# EAGLE design Mjolnir (EAGLE 9.6.2)
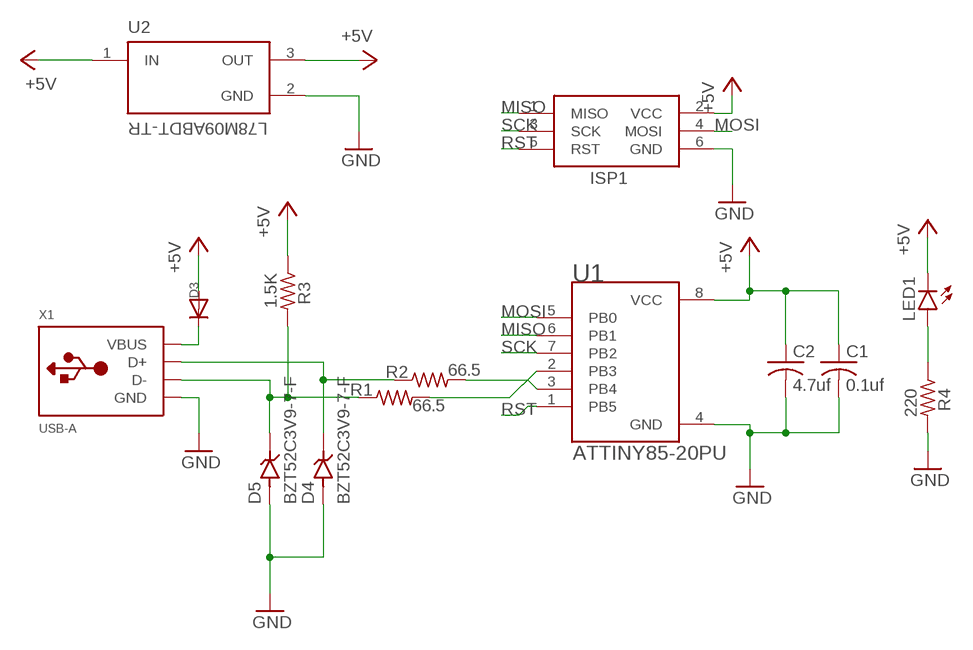
[diagram p0: schematic, sheet 1]

## Parts
C1  0.1uf  C-USC0805  [C0805]
C2  4.7uf  C-USC0805  [C0805]
D3  DIODESOD-123  [SOD-123]
D4  BZT52C3V9-7-F  [SOD3715X145N]
D5  BZT52C3V9-7-F  [SOD3715X145N]
ISP1  AVRISP-6  [AVRISP]
LED1  LEDCHIPLED_0805  [CHIPLED_0805]
R1  66.5  R-US_R0805  [R0805]
R2  66.5  R-US_R0805  [R0805]
R3  1.5K  R-US_R0805  [R0805]
R4  220  R-US_R0805  [R0805]
U1  ATTINY85-20PU  [DIP762W46P254L927H533Q8B]
U2  L78M09ABDT-TR  [VREG_L78M09ABDT-TR]
X1  USB-A  [MOLEX_480371000]

## Nets
+5V: C1.1 C2.1 D3.A ISP1.2(VCC) LED1.C R3.1 U1.8(VCC) U2.1(IN) U2.3(OUT)
GND: C1.2 C2.2 D4.A D5.A ISP1.6(GND) R4.2 U1.4(GND) U2.2(GND) X1.4(GND)
MISO: ISP1.1(MISO) U1.6(PB1)
MOSI: ISP1.4(MOSI) U1.5(PB0)
N$1: LED1.A R4.1
N$2: D3.C X1.1(VBUS)
N$3: D5.C R1.1 R3.2 X1.2(D-)
N$4: R2.2 U1.3(PB4)
N$5: D4.C R2.1 X1.3(D+)
N$6: R1.2 U1.2(PB3)
RST: ISP1.5(RST) U1.1(PB5)
SCK: ISP1.3(SCK) U1.7(PB2)

## Library data of the parts
C1 C2 = adafruit:C-US: CAPACITOR, American symbol
D3 = adafruit:DIODE: Diode SMADIODE - SMA Surface Mount Package 20V 1A Schottky Diode Digikey: 641-1014-6-ND DO-1N4148 - Through Hole Small Current Diode SOD-123 20V 1 A (.5mV Vf) Schottky Diode - Digikey: MBRX120TPMSCT-ND SOD-323 10V 570mA (.38mV Vf, 3ns) Schottky Diode - Digikey: ZLLS410CT-ND SOD-523 30V 30mA Schottky Diode (RB751S-40TE61) - Digikey: RB751S-40TE61CT-ND SOT23-R/W - SOT23 Package (R = Solder Paste/Reflow Ovens, W = Hand-Soldering) BAT54Film 40V 300mA - Digikey: 497-7162-1-ND
D4 D5 = BZT52C3V9-7-F:BZT52C3V9-7-F: Zener Diode 3.9V 500mW ±5% Surface Mount SOD-123 Check prices <https://pricing.snapeda.com/parts/BZT52C3V9-7-F/Diodes%20Inc./view-part?ref=eda>; AVAILABILITY: In Stock; DESCRIPTION: Zener Diode 3.9V 500mW ±5% Surface Mount SOD-123; MF: Diodes Inc.; MP: BZT52C3V9-7-F; PACKAGE: SOD-123 Fairchild Semiconductor; PRICE: None
ISP1 = adafruit:AVRISP: AVR ISP HEADER Standard 6 pin header for AVR programming
LED1 = led:LED: LED OSRAM: - CHIPLED LG R971, LG N971, LY N971, LG Q971, LY Q971, LO R971, LY R971 LH N974, LH R974 LS Q976, LO Q976, LY Q976 LO Q996 - Hyper CHIPLED LW Q18S LB Q993, LB Q99A, LB R99A - SideLED LS A670, LO A670, LY A670, LG A670, LP A670 LB A673, LV A673, LT A673, LW A673 LH A674 LY A675 LS A676, LA A676, LO A676, LY A676, LW A676 LS A679, LY A679, LG A679 - Hyper Micro SIDELED® LS Y876, LA Y876, LO Y876, LY Y876 LT Y87S - SmartLED LW L88C, LW L88S LB L89C, LB L89S, LG L890 LS L89K, LO L89K, LY L89K LS L896, LA L896, LO L896, LY L896 - TOPLED LS T670, LO T670, LY T670, LG T670, LP T670 LSG T670, LSP T670, LSY T670, LOP T670, LYG T670 LG T671, LOG T671, LSG T671 LB T673, LV T673, LT T673, LW T673 LH T674 LS T676, LA T676, LO T676, LY T676, LB T676, LH T676, LSB T676, LW T676 LB T67C, LV T67C, LT T67C, LS T67K, LO T67K, LY T67K, LW E67C LS E67B, LA E67B, LO E67B, LY E67B, LB E67C, LV E67C, LT E67C LW T67C LS T679, LY T679, LG T679 LS T770, LO T770, LY T770, LG T770, LP T770 LB T773, LV T773, LT T773, LW T773 LH T774 LS E675, LA E675, LY E675, LS T675 LS T776, LA T776, LO T776, LY T776, LB T776 LHGB T686 LT T68C, LB T68C - Hyper Mini TOPLED® LB M676 - Mini TOPLED Santana® LG M470 LS M47K, LO M47K, LY M47K Source: http://www.osram.convergy.de LUXEON: - LUMILED® LXK2-PW12-R00, LXK2-PW12-S00, LXK2-PW14-U00, LXK2-PW14-V00 LXK2-PM12-R00, LXK2-PM12-S00, LXK2-PM14-U00 LXK2-PE12-Q00, LXK2-PE12-R00, LXK2-PE12-S00, LXK2-PE14-T00, LXK2-PE14-U00 LXK2-PB12-K00, LXK2-PB12-L00, LXK2-PB12-M00, LXK2-PB14-N00, LXK2-PB14-P00, LXK2-PB14-Q00 LXK2-PR12-L00, LXK2-PR12-M00, LXK2-PR14-Q00, LXK2-PR14-R00 LXK2-PD12-Q00, LXK2-PD12-R00, LXK2-PD12-S00 LXK2-PH12-R00, LXK2-PH12-S00 LXK2-PL12-P00, LXK2-PL12-Q00, LXK2-PL12-R00 Source: www.luxeon.com KINGBRIGHT: KA-3528ASYC Source: www.kingbright.com
R1-R4 = adafruit:R-US_: RESISTOR, American symbol
U1 = ATTINY85-20PU:ATTINY85-20PU: ATtiny Series 20 MHz 8 KB Flash 512 B SRAM 8-Bit Microcontroller - DIP-8 Check prices <https://pricing.snapeda.com/parts/ATTINY85-20PU/Microchip%20Technology/view-part?ref=eda>; AVAILABILITY: In Stock; DESCRIPTION: AVR AVR® ATtiny, Functional Safety (FuSa) Microcontroller IC 8-Bit 20MHz 8KB (4K x 16) FLASH 8-PDIP; MF: Microchip Technology; MP: ATTINY85-20PU; PACKAGE: DIP-8 Atmel; PRICE: None
U2 = L78M09ABDT-TR:L78M09ABDT-TR: Linear Voltage Regulator IC 1 Output 500mA DPAK Check prices <https://pricing.snapeda.com/parts/L78M09ABDT-TR/STMicroelectronics/view-part?ref=eda>; AVAILABILITY: In Stock; DESCRIPTION: Linear Voltage Regulator IC Positive Fixed 1 Output 500mA DPAK; MF: STMicroelectronics; MP: L78M09ABDT-TR; PACKAGE: TO-252 STMicroelectronics; PRICE: None
X1 = adafruit:USB-A: USB type A 'plug' Used for things that can directly connect to a USB port, say USB key

## Board
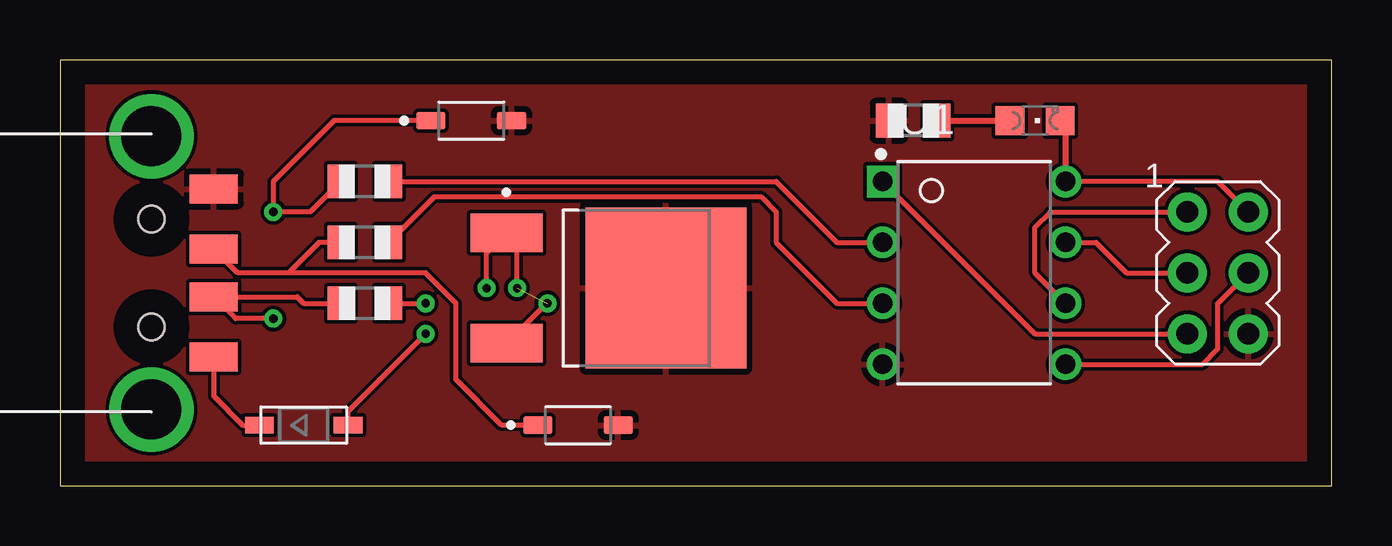
[diagram p1: board, top side]
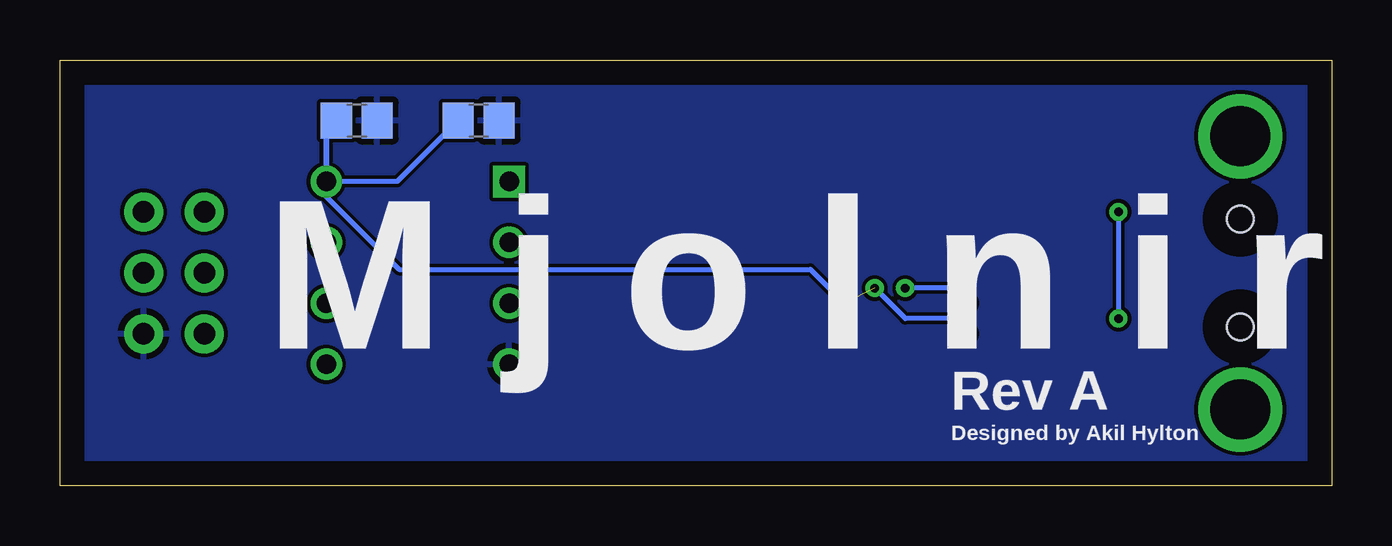
[diagram p2: board, bottom side, seen from below]

Size 53.01 x 17.77 mm. Coordinates in mm from the lower left corner, seen from the top.
Outline: 0,0 53.01,0 53.01,17.77 0,17.77 0,0
Copper layers (1*16): Top 0.035mm / dielectric 1.5mm / Bottom 0.035mm
Design rules "default": minimum track width 6mil, minimum drill 0.35mm, track to track 6mil, track to pad 6mil, pad to pad 6mil, via to via 6mil, smd to smd 6mil, copper to edge 40mil, drill to drill 6mil, minimum pad ring 10mil, minimum via ring 8mil, stop-mask expansion 4mil, vias tented up to drill 0mil, thermal gap 10mil

### Footprints (pad centres in the part's own frame; a part is rotated, then mirrored left to right if it is on the bottom)
C0805 = smd 1.3 x 1.5: 1 -0.85,0; 2 0.85,0
SOD-123 = smd 1.2 x 0.7: A 1.85,0; C -1.85,0
SOD3715X145N = smd 1.21 x 0.73: A 1.68,0; C -1.68,0
AVRISP = drill 0.9 pad 1.626: 1 -1.27,2.54; 2 1.27,2.54; 3 -1.27,0; 4 1.27,0; 5 -1.27,-2.54; 6 1.27,-2.54
CHIPLED_0805 = smd 1.2 x 1.2: A 0,-1.05; C 0,1.05
R0805 = smd 1.1 x 1.4: 1 -1,0; 2 1,0
DIP762W46P254L927H533Q8B = drill 0.813 square: 1 -3.81,3.81 | drill 0.813: 2 -3.81,1.27; 3 -3.81,-1.27; 4 -3.81,-3.81; 5 3.81,-3.81; 6 3.81,-1.27; 7 3.81,1.27; 8 3.81,3.81
VREG_L78M09ABDT-TR = smd 3 x 1.6: 1 -4.25,2.3; 3 -4.25,-2.3 | smd 6.7 x 6.7: 2 2.4,0
MOLEX_480371000 = smd 1.2 x 2: 1 3.5,2.6; 2 1,2.6; 3 -1,2.6; 4 -3.5,2.6 | drill 2.5: M1 -5.7,0; M2 5.7,0 | hole 1.1: -2.25,0; 2.25,0

### Placement (x,y rotation side)
C1  40.64,15.24 0 bottom
C2  35.56,15.24 0 bottom
D3  10.16,2.54 0 top
D4  21.59,2.54 0 top
D5  17.14,15.24 0 top
ISP1  48.26,8.89 0 top
LED1  40.64,15.24 270 top
R1  12.7,12.7 0 top
R2  12.7,10.16 0 top
R3  12.7,7.62 180 top
R4  35.56,15.24 180 top
U1  38.1,8.89 0 top
U2  22.86,8.26 0 top
X1  3.81,8.89 270 top

### Tracks (layer width: path | path; a pad name or v marks a point on that pad's centre or on a via)
+5V  (via drill 0.35)  (1 unrouted)
  Top 0.203: 18.61,5.28 U2.3 20.27,7.62 v20.32,7.62 | R3.1 v15.24,7.62 | v17.78,8.26 17.78,9.72 U2.1 19.05,10.12 v19.05,8.26 | D3.A 12.01,3.12 v15.24,6.35 | ISP1.2 48.26,12.7 U1.8
  Top 0.254: LED1.C 41.91,15.02 U1.8
  Bottom 0.203: v15.24,7.62 15.88,8.26 v17.78,8.26 | v15.24,6.35 15.88,6.99 17.78,6.99 v19.05,8.26 | v20.32,7.62 21.73,9.03 38.88,9.03 41.91,12.06 U1.8 38.95,12.7 C2.1
  Bottom 0.254: C1.1 41.91,14.82 U1.8
GND
  pour Top: 0,17.78 0,0 53.34,0 53.34,17.78
  pour Bottom: 0,17.78 0,0 1.27,0 53.34,0 53.34,1.27 53.34,17.78 50.8,17.78
MISO
  Top 0.203: U1.6 40.64,8.89 40.64,10.79 41.27,11.43 ISP1.1
MOSI
  Top 0.203: U1.5 47.62,5.08 48.26,5.71 48.26,7.62 ISP1.4
N$1
  Top 0.254: R4.1 LED1.A
N$2
  Top 0.203: X1.1 6.41,3.75 7.62,2.54 D3.C
N$3  (via drill 0.35)
  Top 0.203: R3.2 10.16,7.62 9.89,7.89 X1.2 7.32,6.99 v8.89,6.99 | D5.C 11.43,15.24 8.89,12.7 v8.89,11.43 10.43,11.43 R1.1
  Bottom 0.203: v8.89,11.43 v8.89,6.99
N$4
  Top 0.203: R2.2 15.61,12.06 29.21,12.06 29.84,11.43 29.84,10.16 32.38,7.62 U1.3
N$5
  Top 0.203: 11.7,9.89 R2.1 10.79,10.16 9.53,8.89 | 6.68,10.16 X1.3 7.41,8.89 9.53,8.89 | D4.C 18.41,2.54 16.51,4.45 16.51,7.62 15.24,8.89 9.53,8.89
N$6
  Top 0.203: R1.2 29.84,12.7 32.38,10.16 U1.2
RST
  Top 0.203: U1.1 40.64,6.35 ISP1.5
SCK
  Top 0.203: U1.7 43.18,10.16 44.45,8.89 ISP1.3

### Text on the board
bPlace: M j o l n i r | Rev A | Designed by Akil Hylton